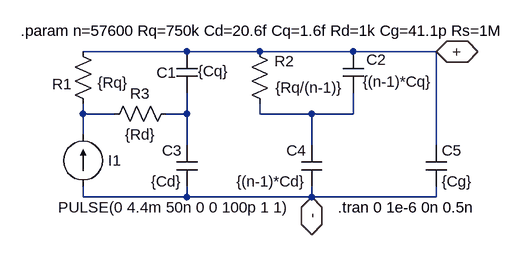
[diagram p0: schematic SiPM.asc]
SiPM.asc, the LTspice schematic file:
Version 4
SHEET 1 880 680
WIRE 176 256 16 256
WIRE 288 256 176 256
WIRE 432 256 288 256
WIRE 560 256 432 256
WIRE 16 352 16 336
WIRE 64 352 16 352
WIRE 176 352 176 320
WIRE 176 352 144 352
WIRE 288 352 288 336
WIRE 368 352 288 352
WIRE 432 352 432 320
WIRE 432 352 368 352
WIRE 16 384 16 352
WIRE 176 400 176 352
WIRE 368 400 368 352
WIRE 560 400 560 256
WIRE 16 480 16 464
WIRE 176 480 176 464
WIRE 176 480 16 480
WIRE 368 480 368 464
WIRE 368 480 176 480
WIRE 560 480 560 464
WIRE 560 480 368 480
FLAG 560 256 +
IOPIN 560 256 BiDir
FLAG 368 480 -
IOPIN 368 480 BiDir
SYMBOL res 0 240 R0
WINDOW 0 -32 66 Left 2
WINDOW 3 38 64 Left 2
SYMATTR InstName R1
SYMATTR Value {Rq}
SYMBOL res 272 240 R0
WINDOW 0 39 31 Left 2
WINDOW 3 93 87 Bottom 2
SYMATTR InstName R2
SYMATTR Value {Rq/(n-1)}
SYMBOL res 160 336 R90
WINDOW 0 0 56 VBottom 2
WINDOW 3 32 56 VTop 2
SYMATTR InstName R3
SYMATTR Value {Rd}
SYMBOL Cap 192 320 R180
WINDOW 0 32 32 Left 2
WINDOW 3 -48 34 Left 2
SYMATTR InstName C1
SYMATTR Value {Cq}
SYMBOL Cap 448 320 R180
WINDOW 0 -35 52 Left 2
WINDOW 3 -53 2 Top 2
SYMATTR InstName C2
SYMATTR Value {(n-1)*Cq}
SYMBOL Cap 192 464 R180
WINDOW 0 24 56 Left 2
WINDOW 3 24 8 Left 2
SYMATTR InstName C3
SYMATTR Value {Cd}
SYMBOL Cap 384 464 R180
WINDOW 0 24 56 Left 2
WINDOW 3 24 8 Left 2
SYMATTR InstName C4
SYMATTR Value {(n-1)*Cd}
SYMBOL current 16 464 R180
WINDOW 0 -59 40 Left 2
WINDOW 3 -319 -32 Left 2
WINDOW 39 0 0 Left 0
SYMATTR InstName I1
SYMATTR Value PULSE(0 4.4m 50n 0 0 100p 1 1)
SYMBOL Cap 544 400 R0
SYMATTR InstName C5
SYMATTR Value {Cg}
TEXT 408 496 Left 2 !.tran 0 1e-6 0n 0.5n
TEXT -80 224 Left 2 !.param n=57600 Rq=750k Cd=20.6f Cq=1.6f Rd=1k Cg=41.1p Rs=1M

The netlist it stands for:
* SiPM.asc
R1 + N001 {Rq}
R2 + N003 {Rq/(n-1)}
R3 N002 N001 {Rd}
C1 N002 + {Cq}
C2 N003 + {(n-1)*Cq}
C3 - N002 {Cd}
C4 - N003 {(n-1)*Cd}
I1 - N001 PULSE(0 4.4m 50n 0 0 100p 1 1)
C5 + - {Cg}
.tran 0 1e-6 0n 0.5n
.param n=57600 Rq=750k Cd=20.6f Cq=1.6f Rd=1k Cg=41.1p Rs=1M
.backanno
.end